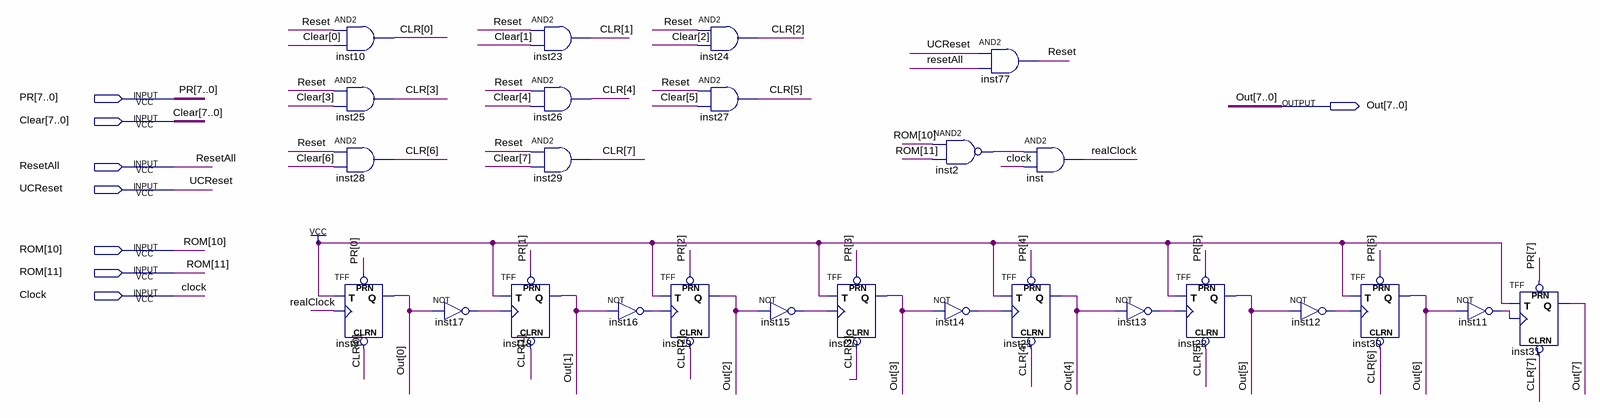
[diagram p0: schematic sheet]
// Quartus schematic ContadorAssincrono.bdf as structural Verilog: 26 symbols, 8 pins
module ContadorAssincrono (
  input  [7:0] PR,
  input  [7:0] Clear,
  input  ResetAll,
  input  UCReset,
  input  [11:10] ROM,
  input  Clock,
  output [7:0] Out
);

  wire inst2_out, inst11_out, inst12_out, inst13_out, inst14_out, inst15_out, inst16_out, inst17_out,
       realClock, Reset;
  wire [7:0] CLR;

  and inst10 (CLR[0], Reset, Clear[0]);
  and inst25 (CLR[3], Reset, Clear[3]);
  and inst28 (CLR[6], Reset, Clear[6]);
  TFF inst9 (.PRN(PR[0]), .CLRN(CLR[0]), .T(1'b1), .CLK(realClock), .Q(Out[0]));
  not inst17 (inst17_out, Out[0]);
  TFF inst18 (.PRN(PR[1]), .CLRN(CLR[1]), .T(1'b1), .CLK(inst17_out), .Q(Out[1]));
  and inst23 (CLR[1], Reset, Clear[1]);
  and inst26 (CLR[4], Reset, Clear[4]);
  and inst29 (CLR[7], Reset, Clear[7]);
  not inst16 (inst16_out, Out[1]);
  and inst24 (CLR[2], Reset, Clear[2]);
  and inst27 (CLR[5], Reset, Clear[5]);
  TFF inst19 (.PRN(PR[2]), .CLRN(CLR[2]), .T(1'b1), .CLK(inst16_out), .Q(Out[2]));
  not inst15 (inst15_out, Out[2]);
  TFF inst20 (.PRN(PR[3]), .CLRN(CLR[3]), .T(1'b1), .CLK(inst15_out), .Q(Out[3]));
  nand inst2 (inst2_out, ROM[10], ROM[11]);
  not inst14 (inst14_out, Out[3]);
  and inst77 (Reset, UCReset, ResetAll);
  TFF inst21 (.PRN(PR[4]), .CLRN(CLR[4]), .T(1'b1), .CLK(inst14_out), .Q(Out[4]));
  and inst (realClock, inst2_out, Clock);
  not inst13 (inst13_out, Out[4]);
  TFF inst22 (.PRN(PR[5]), .CLRN(CLR[5]), .T(1'b1), .CLK(inst13_out), .Q(Out[5]));
  not inst12 (inst12_out, Out[5]);
  TFF inst30 (.PRN(PR[6]), .CLRN(CLR[6]), .T(1'b1), .CLK(inst12_out), .Q(Out[6]));
  not inst11 (inst11_out, Out[6]);
  TFF inst31 (.PRN(PR[7]), .CLRN(CLR[7]), .T(1'b1), .CLK(inst11_out), .Q(Out[7]));
endmodule
